# Altium schematic sheet cellular.SchDoc
size B
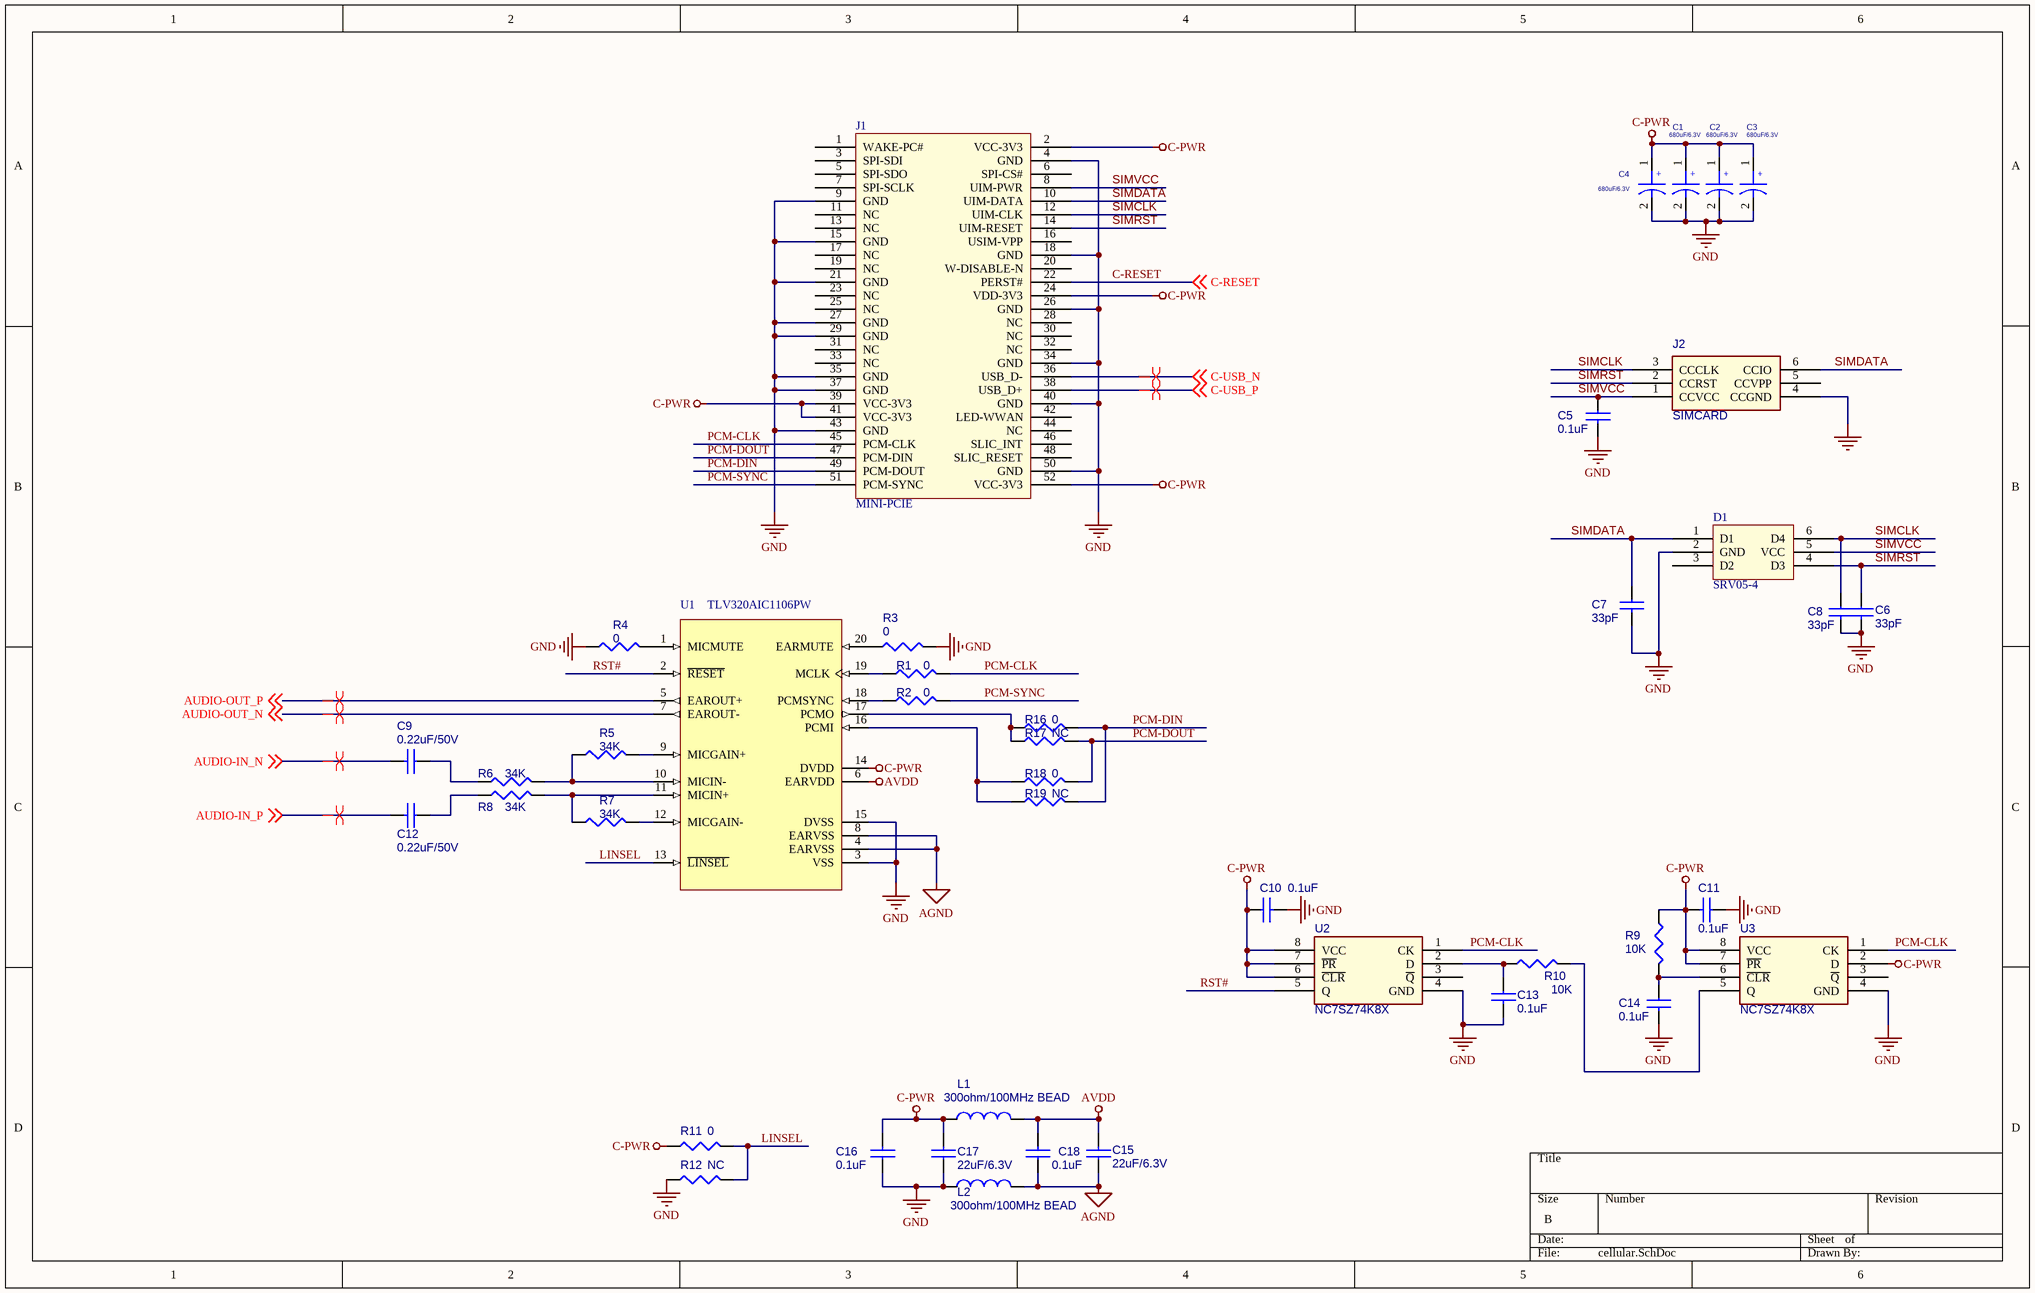
[diagram p0: cellular.SchDoc]

## Parts
C1  680uF/6.3V  [7343]
C2  680uF/6.3V  [7343]
C3  680uF/6.3V  [7343]
C4  680uF/6.3V  [7343]
C5  0.1uF  [0603]
C6  33pF  [0603]
C7  33pF  [0603]
C8  33pF  [0603]
C9  0.22uF/50V  [0603]
C10  0.1uF  [0603]
C11  0.1uF  [0603]
C12  0.22uF/50V  [0603]
C13  0.1uF  [0603]
C14  0.1uF  [0603]
C15  22uF/6.3V  [0805]
C16  0.1uF  [0603]
C17  22uF/6.3V  [0805]
C18  0.1uF  [0603]
D1  SRV05-4  [SOT23-6]
J1  MINI-PCIE
J2  SIMCARD  [SIMLOCK]
L1  300ohm/100MHz BEAD  [0603]
L2  300ohm/100MHz BEAD  [0603]
R1  0  [0603]
R2  0  [0603]
R3  0  [0603]
R4  0  [0603]
R5  34K  [0603]
R6  34K  [0603]
R7  34K  [0603]
R8  34K  [0603]
R9  10K  [0603]
R10  10K  [0603]
R11  0  [0603]
R12  NC  [0603]
R16  0  [0603]
R17  NC  [0603]
R18  0  [0603]
R19  NC  [0603]
U1  TLV320AIC1106PW  [PW020]
U2  NC7SZ74K8X  [US8]
U3  NC7SZ74K8X  [US8]

## Nets
AGND: C15.1 C18.1 L2.1 U1.4(EARVSS) U1.8(EARVSS)
AVDD: C15.2 C18.2 L1.1 U1.6(EARVDD)
C-PWR: C1.1 C2.1 C3.1 C4.1 C10.1 C11.2 C16.2 C17.2 J1.2(VCC-3V3) J1.24(VDD-3V3) J1.39(VCC-3V3) J1.41(VCC-3V3) J1.52(VCC-3V3) L1.2 R9.2 R11.2 U1.14(DVDD) U2.6(~{CLR}) U2.7(~{PR}) U2.8(VCC) U3.2(D) U3.7(~{PR}) U3.8(VCC)
GND: C1.2 C2.2 C3.2 C4.2 C5.2 C6.2 C7.2 C8.2 C10.2 C11.1 C13.2 C14.2 C16.1 C17.1 D1.2(GND) J1.4(GND) J1.9(GND) J1.15(GND) J1.18(GND) J1.21(GND) J1.26(GND) J1.27(GND) J1.29(GND) J1.34(GND) J1.35(GND) J1.37(GND) J1.40(GND) J1.43(GND) J1.50(GND) J2.4(CCGND) L2.2 R3.1 R4.2 R12.2 U1.3(VSS) U1.15(DVSS) U2.4(GND) U3.4(GND)
AUDIO-IN_N: C9.2 ; off-sheet AUDIO-IN_N
AUDIO-IN_P: C12.2 ; off-sheet AUDIO-IN_P
AUDIO-OUT_N: U1.7(EAROUT-) ; off-sheet AUDIO-OUT_N
AUDIO-OUT_P: U1.5(EAROUT+) ; off-sheet AUDIO-OUT_P
C-RESET: J1.22(PERST#) ; off-sheet C-RESET
C-USB_N: J1.36(USB_D-) ; off-sheet C-USB_N
C-USB_P: J1.38(USB_D+) ; off-sheet C-USB_P
LINSEL: R11.1 R12.1 U1.13(~{LINSEL})
PCM-CLK: J1.45(PCM-CLK) R1.1 U2.1(CK) U3.1(CK)
PCM-DIN: J1.49(PCM-DOUT) R16.1 R19.1
PCM-DOUT: J1.47(PCM-DIN) R17.1 R18.1
PCM-SYNC: J1.51(PCM-SYNC) R2.1
RST#: U1.2(~{RESET}) U2.5(Q)
SIMCLK: C8.1 D1.6(D4) J1.12(UIM-CLK) J2.3(CCCLK)
SIMDATA: C7.1 D1.1(D1) J1.10(UIM-DATA) J2.6(CCIO)
SIMRST: C6.1 D1.4(D3) J1.14(UIM-RESET) J2.2(CCRST)
SIMVCC: C5.1 D1.5(VCC) J1.8(UIM-PWR) J2.1(CCVCC)
NetC9_1: C9.1 R6.2
NetC12_1: C12.1 R8.2
NetC13_1: C13.1 R10.2 U2.2(D)
NetC14_1: C14.1 R9.1 U3.6(~{CLR})
NetR1_2: R1.2 U1.19(MCLK)
NetR2_2: R2.2 U1.18(PCMSYNC)
NetR3_2: R3.2 U1.20(EARMUTE)
NetR4_1: R4.1 U1.1(MICMUTE)
NetR5_1: R5.1 U1.9(MICGAIN+)
NetR5_2: R5.2 R6.1 U1.10(MICIN-)
NetR7_1: R7.1 U1.12(MICGAIN-)
NetR7_2: R7.2 R8.1 U1.11(MICIN+)
NetR10_1: R10.1 U3.5(Q)
NetR16_2: R16.2 R17.2 U1.17(PCMO)
NetR18_2: R18.2 R19.2 U1.16(PCMI)

Not connected (* = marked no-connect by the designer): D1 3(D2); J1 1(WAKE-PC#) 3(SPI-SDI) 5(SPI-SDO) 6(SPI-CS#) 7(SPI-SCLK) 11(NC) 13(NC) 16(USIM-VPP) 17(NC) 19(NC) 20(W-DISABLE-N) 23(NC) 25(NC) 28(NC) 30(NC) 31(NC) 32(NC) 33(NC) 42(LED-WWAN) 44(NC) 46(SLIC_INT) 48(SLIC_RESET); J2 5(CCVPP); U2 3(~{Q}); U3 3(~{Q})

## Layout directives
differential pair: AUDIO-IN_N, AUDIO-IN_P, AUDIO-OUT_N, AUDIO-OUT_P, C-USB_N, C-USB_P

## Notes on the sheet
- (in symbol 10U-6032-20V) +

## Library data of the parts
C1-C4 = 10U-6032-20V: CAP;10U  ,TT,20V ,20%,6032,SMT
C5-C18 = P_CAP NP
L1 L2 = INDUCTOR_4
R1-R12 R16-R19 = P_R
U1 = TLV320AIC1106PWG4: PCM CODEC With Microphone Amps & Speaker Driver, 20-Pin TSSOP; Published: 16-Dec-2005; DatasheetVersion: 13-Sep-2005; PackageVersion: Feb-1999; PackageReference: PW020; Publisher: Altium Limited; PackageDescription: Shrink Small Outline; 20 Leads; Body Width 4.4 mm; Pitch 0.65 mm; ComponentLink1Description: Manufacturer Link; ComponentLink1URL: http://www.ti.com/; ComponentLink2Description: Datasheet; ComponentLink2URL: http://focus.ti.com/lit/ds/symlink/tlv320aic1106.pdf
U2 U3 = NC7SZ74-US8_0: IC;NC7SZ74,D-TYPE FLIP-FLOP,US8; VENDER: FAIRCHILD; P/N: XXXXXXXXXXXX; PKG: US8; device: US8